# EAGLE design UL-17 (EAGLE 4.11)
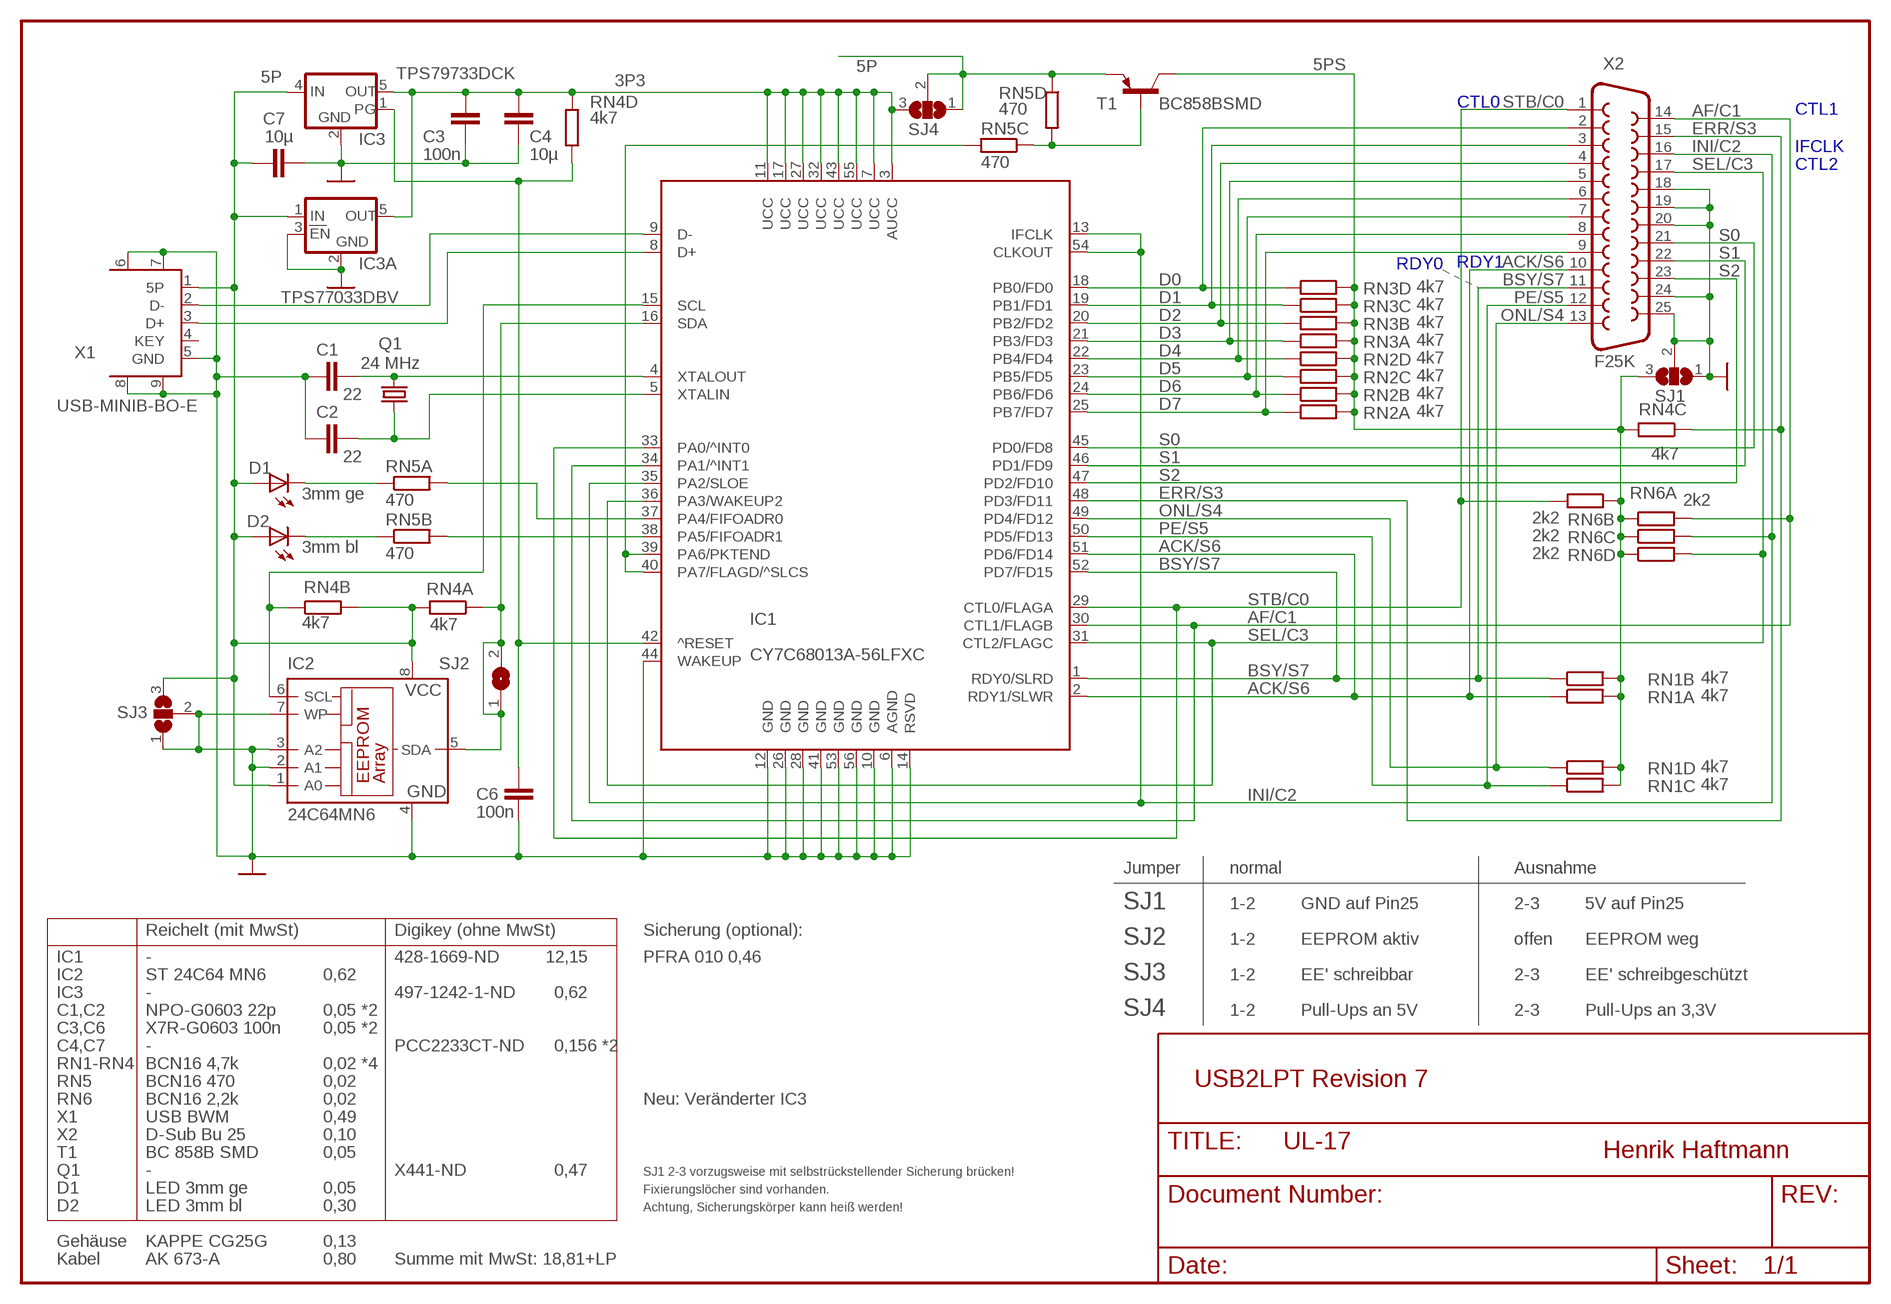
[diagram p0: schematic, sheet 1]

## Parts
C1  22  C-EUC0603  [C0603]
C2  22  C-EUC0603  [C0603]
C3  100n  C-EUC0603  [C0603]
C4  10µ  C-EUC0805  [C0805]
C6  100n  C-EUC0603  [C0603]
C7  10µ  C-EUC0805  [C0805]
D1  3mm ge  LED3MM  [LED3MM]
D2  3mm bl  LED3MM  [LED3MM]
IC1  CY7C68013A-56LFXC  [MLF56]
IC2  24C64MN6  24C32ASN  [SO-08]
IC3  TPS79733DCK  [SOT323-5]
IC3A  TPS77033DBV  [SOT23-5]
Q1  24 MHz  CRYTALHC49U-V  [HC49U-V]
RN1  4k7  RN-4P1206  [R-4P]
RN2  4k7  RN-4P1206  [R-4P]
RN3  4k7  RN-4P1206  [R-4P]
RN4  4k7  RN-4P1206  [R-4P]
RN5  470  RN-4P1206  [R-4P]
RN6  2k2  RN-4P1206  [R-4P]
SJ1  SJ3P  [SJ3P]
SJ2  SJ2P  [SJ2P]
SJ3  SJ3P  [SJ3P]
SJ4  SJ3P  [SJ3P]
T1  BC858BSMD  [SOT23-BEC]
X1  USB-MINIB-BO-E  [USB-MINIB-BU-E]
X2  F25K  [F25K]

## Nets
3P3: C3.2 C4.2 IC1.3(AUCC) IC1.7(UCC) IC1.11(UCC) IC1.17(UCC) IC1.27(UCC) IC1.32(UCC) IC1.43(UCC) IC1.55(UCC) IC3.5(OUT) IC3A.5(OUT) RN4.4 SJ4.3
5P: C7.2 D1.A D2.A IC2.1(A0) IC2.8(VCC) IC3.4(IN) IC3A.1(IN) RN4.7 RN4.8 RN5.4 SJ3.3 SJ4.1 SJ4.2 T1.E X1.1(5P)
5PS: RN1.5 RN1.6 RN1.7 RN1.8 RN2.5 RN2.6 RN2.7 RN2.8 RN3.5 RN3.6 RN3.7 RN3.8 RN4.6 RN6.1 RN6.2 RN6.3 RN6.4 SJ1.3 T1.C
ACK/S6: IC1.2(RDY1/SLWR) IC1.51(PD6/FD14) RN1.1 X2.10
AF/C1: IC1.30(CTL1/FLAGB) IC1.34(PA1/^INT1) RN6.7 X2.14
BSY/S7: IC1.1(RDY0/SLRD) IC1.52(PD7/FD15) RN1.2 X2.11
D0: IC1.18(PB0/FD0) RN3.4 X2.2
D1: IC1.19(PB1/FD1) RN3.3 X2.3
D2: IC1.20(PB2/FD2) RN3.2 X2.4
D3: IC1.21(PB3/FD3) RN3.1 X2.5
D4: IC1.22(PB4/FD4) RN2.4 X2.6
D5: IC1.23(PB5/FD5) RN2.3 X2.7
D6: IC1.24(PB6/FD6) RN2.2 X2.8
D7: IC1.25(PB7/FD7) RN2.1 X2.9
D+: IC1.8(D+) X1.3(D+)
D-: IC1.9(D-) X1.2(D-)
ERR/S3: IC1.48(PD3/FD11) RN4.3 X2.15
GND: C1.2 C2.2 C3.1 C4.1 C6.1 C7.1 IC1.6(AGND) IC1.10(GND) IC1.12(GND) IC1.14(RSVD) IC1.26(GND) IC1.28(GND) IC1.41(GND) IC1.44(WAKEUP) IC1.53(GND) IC1.56(GND) IC2.2(A1) IC2.3(A2) IC2.4(GND) IC2.7(WP) IC3.2(GND) IC3A.2(GND) IC3A.3(/EN) SJ1.1 SJ1.2 SJ3.1 SJ3.2 X1.5(GND) X1.6(GND) X1.7(GND) X1.8(GND) X1.9(GND) X2.18 X2.19 X2.20 X2.24 X2.25
INI/C2: IC1.13(IFCLK) IC1.35(PA2/SLOE) IC1.54(CLKOUT) RN6.6 X2.16
LEDBLAU: IC1.38(PA5/FIFOADR1) RN5.7
LEDGELB: IC1.37(PA4/FIFOADR0) RN5.8
N$1: C2.1 IC1.5(XTALIN) Q1.1
N$2: C1.1 IC1.4(XTALOUT) Q1.2
N$5: D2.K RN5.2
N$7: D1.K RN5.1
N$12: RN5.3 RN5.5 T1.B
N$15: IC1.39(PA6/PKTEND) IC1.40(PA7/FLAGD/^SLCS) RN5.6
ONL/S4: IC1.49(PD4/FD12) RN1.4 X2.13
PE/S5: IC1.50(PD5/FD13) RN1.3 X2.12
RESET: C6.2 IC1.42(^RESET) IC3.1(PG) RN4.5
S0: IC1.45(PD0/FD8) X2.21
S1: IC1.46(PD1/FD9) X2.22
S2: IC1.47(PD2/FD10) X2.23
SCL: IC1.15(SCL) IC2.6(SCL) RN4.2
SDA: IC1.16(SDA) IC2.5(SDA) RN4.1 SJ2.1 SJ2.2
SEL/C3: IC1.31(CTL2/FLAGC) IC1.36(PA3/WAKEUP2) RN6.5 X2.17
STB/C0: IC1.29(CTL0/FLAGA) IC1.33(PA0/^INT0) RN6.8 X2.1
Unconnected: X1.4(KEY)

## Notes on the sheet
- CTL0
- CTL1
- IFCLK
- CTL2
- RDY0 | RDY1
- Jumper | normal | Ausnahme
- SJ1 | 1-2 | GND auf Pin25 | 2-3 | 5V auf Pin25
- Reichelt (mit MwSt) | Digikey (ohne MwSt) | Sicherung (optional):
- SJ2 | 1-2 | EEPROM aktiv | offen | EEPROM weg
- IC1 | - | 428-1669-ND | 12,15 | PFRA 010 0,46
- IC2 | ST 24C64 MN6 | 0,62 | SJ3 | 1-2 | EE' schreibbar | 2-3 | EE' schreibgeschützt
- IC3 | - | 497-1242-1-ND | 0,62
- C1,C2 | NPO-G0603 22p | 0,05 *2 | SJ4 | 1-2 | Pull-Ups an 5V | 2-3 | Pull-Ups an 3,3V
- C3,C6 | X7R-G0603 100n | 0,05 *2
- C4,C7 | - | PCC2233CT-ND | 0,156 *2
- RN1-RN4 | BCN16 4,7k | 0,02 *4
- RN5 | BCN16 470 | 0,02 | USB2LPT Revision 7
- RN6 | BCN16 2,2k | 0,02 | Neu: Veränderter IC3
- X1 | USB BWM | 0,49
- X2 | D-Sub Bu 25 | 0,10
- T1 | BC 858B SMD | 0,05 | Henrik Haftmann
- Q1 | - | X441-ND | 0,47 | SJ1 2-3 vorzugsweise mit selbstrückstellender Sicherung brücken!
- D1 | LED 3mm ge | 0,05 | Fixierungslöcher sind vorhanden.
- D2 | LED 3mm bl | 0,30 | Achtung, Sicherungskörper kann heiß werden!
- Gehäuse | KAPPE CG25G | 0,13
- Kabel | AK 673-A | 0,80 | Summe mit MwSt: 18,81+LP

## Library data of the parts
C1-C4 C6 C7 = rcl:C-EU: CAPACITOR, European symbol
D1 D2 = hs-ul:LED: Leuchtdiode 2 Anschlüsse
IC1 = hs-ul:CY7C68013*-56: Zuordnungstabelle Vorn SSOP56 LF56 Pb Pb-frei Pb Pb-frei FX2 CY7C68013 -56PVC -56PVXC -56LFC -56LFXC FX2LP CY7C68013 A-56PVC A-56PVXC A-56LFC A-56LFXC
IC2 = microchip:24*: Serial EEPROM I2C
IC3 = hs-ul:TPS797*: Längsregler 50 mA, feste Ausgangsspannungen Mit Power-Good-Ausgang, Low-Drop, nur 1,3 µA Querstrom Texas Instruments (kostenlose Muster) alternativ TPS715XX (ohne Power-Good-Ausgang)
IC3A = hs-ul:TPS770*: Längsregler 50 mA, feste Ausgangsspannungen Mit Power-Good-Ausgang, Low-Drop, 17 µA Querstrom Texas Instruments (kostenlose Muster) alternativ TPS788XX
Q1 = crystal:CRYTAL: CRYSTAL
RN1-RN6 = hs-ul:RN-4P: Widerstandsnetzwerk 4 Parallel
SJ1 SJ3 SJ4 = hs-ul:SJ3P: Lötbrücke 3pol. Spaltbreite 0,15 mm
SJ2 = hs-ul:SJ2P: Lötbrücke 2pol. Spaltbreite 0,15 mm
T1 = transistor-pnp:BC858*: PNP Transistror
X1 = hs-ul:USB-MINIB-BO: USB MiniB-Buchse Oberflächenmontage (Zwei Varianten zur Kantenmontage)
X2 = hs-ul:F25: SubD-Buchse korrigiert und verschönert Kantenmontage Reichelt D-SUB BU 25 0,14€

## Board
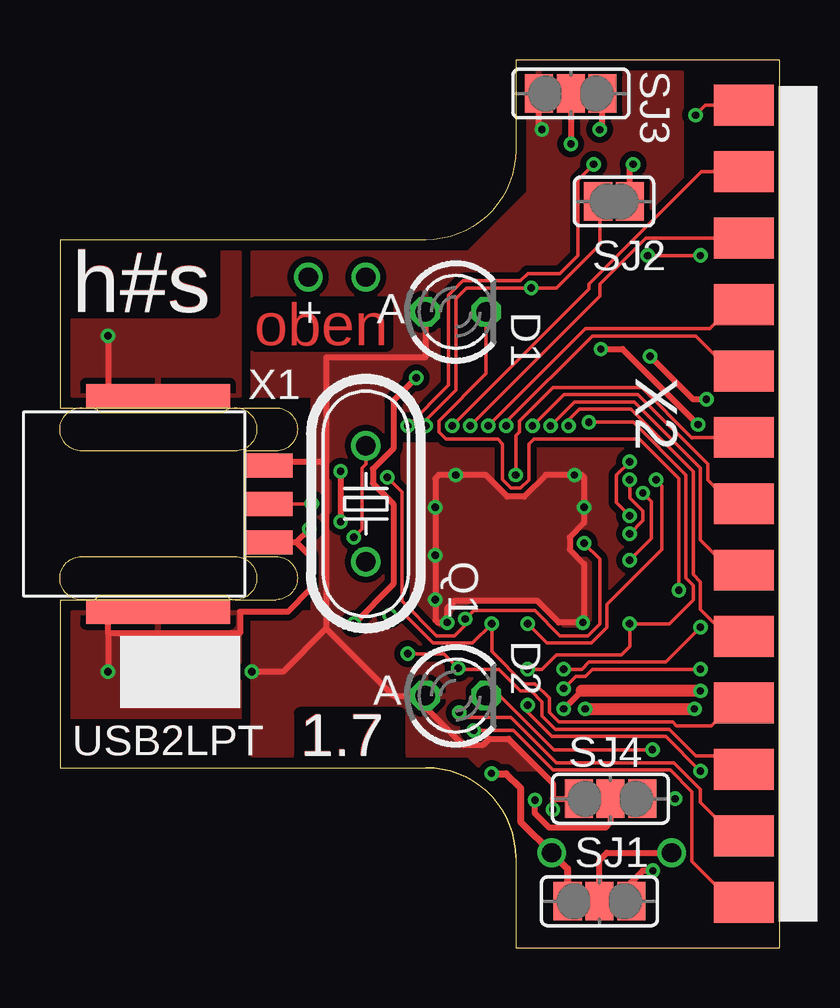
[diagram p1: board, top side]
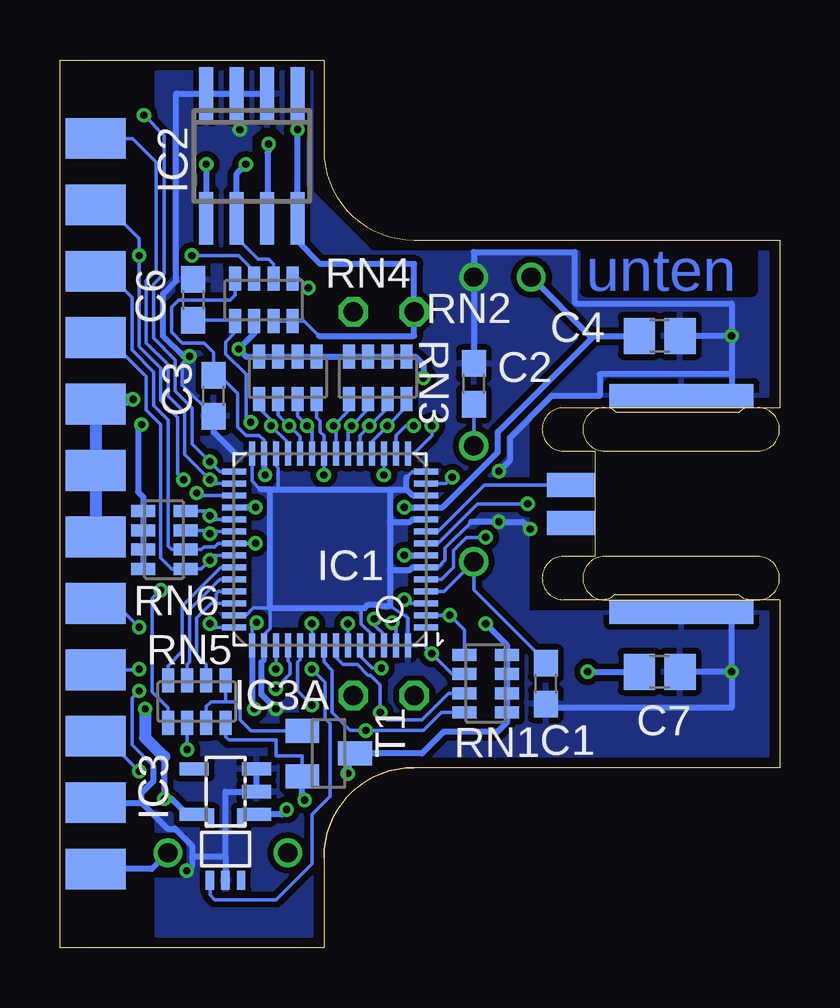
[diagram p2: board, bottom side, seen from below]

Size 30 x 37 mm. Coordinates in mm from the lower left corner, seen from the top.
Outline: 15.25,7.5 0,7.5 0,14.5 1.13,14.5 arc45 1.66,14.66 1.7,14.7 6.9,14.7 6.97,14.63 arc45 7.33,14.5 9,14.5 arc180 9,16.3 7.7,16.3 7.7,20.7 9,20.7 arc180 9,22.5 7.25,22.5 arc45 6.82,22.32 6.8,22.3 1.7,22.3 1.68,22.32 arc45 1.25,22.5 0,22.5 0,29.5 15.25,29.5 arc90 19,33.25 19,37 30,37 30,0 19,0 19,3.75
Outline: 15.25,7.5 arc-90 19,3.75
Outline: 19,3.75 arc90 15.25,7.5
Copper layers (1*16): Top 0.035mm / dielectric 1.4mm / Bottom 0.035mm
Design rules "default": minimum track width 0.15mm, minimum drill 0.3mm, track to track 0.15mm, track to pad 0.15mm, pad to pad 0.15mm, via to via 0.15mm, smd to smd 0mil, copper to edge 0mil, drill to drill 0.15mm, minimum pad ring 0.15mm, minimum via ring 0.15mm, stop-mask expansion 4mil, vias tented up to drill 0.4mm, thermal gap 10mil
Milling: 8 lines

### Footprints (pad centres in the part's own frame; a part is rotated, then mirrored left to right if it is on the bottom)
C0603 = smd 1.1 x 1: 1 -0.85,0; 2 0.85,0
C0805 = smd 1.3 x 1.5: 1 -0.85,0; 2 0.85,0
LED3MM = drill 0.813 octagon: A -1.27,0; K 1.27,0
MLF56 = smd 1 x 0.25: 1 -4,3.25; 2 -4,2.75; 3 -4,2.25; 4 -4,1.75; 5 -4,1.25; 6 -4,0.75; 7 -4,0.25; 8 -4,-0.25; 9 -4,-0.75; 10 -4,-1.25; 11 -4,-1.75; 12 -4,-2.25; 13 -4,-2.75; 14 -4,-3.25; 29 4,-3.25; 30 4,-2.75; 31 4,-2.25; 32 4,-1.75; 33 4,-1.25; 34 4,-0.75; 35 4,-0.25; 36 4,0.25; 37 4,0.75; 38 4,1.25; 39 4,1.75; 40 4,2.25; 41 4,2.75; 42 4,3.25 | smd 0.25 x 1: 15 -3.25,-4; 16 -2.75,-4; 17 -2.25,-4; 18 -1.75,-4; 19 -1.25,-4; 20 -0.75,-4; 21 -0.25,-4; 22 0.25,-4; 23 0.75,-4; 24 1.25,-4; 25 1.75,-4; 26 2.25,-4; 27 2.75,-4; 28 3.25,-4; 43 3.25,4; 44 2.75,4; 45 2.25,4; 46 1.75,4; 47 1.25,4; 48 0.75,4; 49 0.25,4; 50 -0.25,4; 51 -0.75,4; 52 -1.25,4; 53 -1.75,4; 54 -2.25,4; 55 -2.75,4; 56 -3.25,4
SO-08 = smd 0.6 x 2.2: 1 -1.905,-2.6; 2 -0.635,-2.6; 3 0.635,-2.6; 4 1.905,-2.6; 5 1.905,2.6; 6 0.635,2.6; 7 -0.635,2.6; 8 -1.905,2.6
SOT323-5 = smd 0.35 x 0.8: 1 -0.65,-1.3; 2 0,-1.3; 3 0.65,-1.3; 4 0.65,1.3; 5 -0.65,1.3
SOT23-5 = smd 0.55 x 1.2: 1 -0.95,-1.3; 2 0,-1.3; 3 0.95,-1.3; 4 0.95,1.3; 5 -0.95,1.3
HC49U-V = drill 0.813 round: 1 -2.413,0; 2 2.413,0
R-4P = smd 0.5 x 1: 1 -1.2,-0.88; 2 -0.4,-0.88; 3 0.4,-0.88; 4 1.2,-0.88; 5 1.2,0.88; 6 0.4,0.88; 7 -0.4,0.88; 8 -1.2,0.88
SJ3P = smd 1.168 x 1.6: 1 -1.324,0; 2 0,0; 3 1.324,0
SJ2P = smd 1.168 x 1.6: 1 -0.662,0; 2 0.662,0
SOT23-BEC = smd 1 x 1.4: B -0.95,-1.1; C 0,1.1; E 0.95,-1.1
USB-MINIB-BU-E = smd 2 x 1: 1 9.6,1.6; 3 9.6,0; 5 9.6,-1.6 | smd 2 x 1 bottom: 2 9.6,0.8; 4 9.6,-0.8 | smd 6 x 1 bottom: 6 5,4.5; 9 5,-4.5 | smd 6 x 1: 7 5,4.5; 8 5,-4.5
F25K = smd 1.7 x 2.5: 1 -16.612,-1.75; 2 -13.843,-1.75; 3 -11.074,-1.75; 4 -8.306,-1.75; 5 -5.537,-1.75; 6 -2.769,-1.75; 7 0,-1.75; 8 2.769,-1.75; 9 5.537,-1.75; 10 8.306,-1.75; 11 11.074,-1.75; 12 13.843,-1.75; 13 16.612,-1.75 | smd 1.7 x 2.5 bottom: 14 -15.227,-1.75; 15 -12.459,-1.75; 16 -9.69,-1.75; 17 -6.921,-1.75; 18 -4.153,-1.75; 19 -1.384,-1.75; 20 1.384,-1.75; 21 4.153,-1.75; 22 6.921,-1.75; 23 9.69,-1.75; 24 12.459,-1.75; 25 15.227,-1.75

### Placement (x,y rotation side)
C1  9.75,11 270 bottom
C2  12.75,23.5 90 bottom
C3  23.6,23 90 bottom
C4  5,25.5 180 bottom
C6  24.45,27 270 bottom
C7  5,11.5 180 bottom
D1  16.5,26.5 0 top
D2  16.5,10.5 0 top
IC1  18.75,16.6 180 bottom
IC2  22,33 180 bottom
IC3  23.1,4.1 0 bottom
IC3A  23.1,6.5 90 bottom
Q1  12.75,18.5 270 top
RN1  12.25,11 270 bottom
RN2  20.5,23.75 0 bottom
RN3  16.75,23.75 0 bottom
RN4  21.5,27 180 bottom
RN5  24.3,10.25 0 bottom
RN6  25.65,16.99 270 bottom
SJ1  22.49,1.93 180 top
SJ2  23.1,31.1 180 top
SJ3  21.3,35.6 180 top
SJ4  22.95,6.2 0 top
T1  18.8,8.09 270 bottom
X1  -0.91,18.49 0 top
X2  30.25,18.5 270 top

### Tracks (layer width: path | path; a pad name or v marks a point on that pad's centre or on a via)
3P3  (via drill 0.3, 0.8)
  Top 0.15: v25.65,6.2 SJ4.3
  Top 0.25: v16.5,19.7 15.8,19.7 15.65,19.55 v15.65,18.35 v15.65,16.35 v15.65,14.5 15.65,13.65 15.75,13.55 v16.15,13.55 16.15,14.15 16.45,14.45 19.9,14.45 20.8,13.55 v21.8,13.55 21.85,13.6 21.85,16 21.25,16.6 21.25,17.1 21.85,17.7 v21.85,18.35 21.85,19.6 21.75,19.7 v21.45,19.7 20.25,19.7 19.35,18.8 18.65,18.8 17.75,19.7 v16.5,19.7
  Top 0.5: v21.9,9.95 v26.45,9.95
  Bottom 0.15: v16.5,19.7 IC1.17 | v15.65,14.5 15.5,14.35 IC1.3 | IC1.55 16,13.4 v16.15,13.55 | IC1.27 21.5,21.15 21.7,21.35 22.25,21.35 22.6,21.7 22.6,23.1 23.35,23.85 C3.2 23.6,24.8 24,25.2 24.9,25.2 25.35,25.65 25.35,26.7 25.05,27 22.9,27 22.7,27.2 RN4.4 | IC1.43 22,13.35 v21.8,13.55
  Bottom 0.25: IC1.27 21.5,19.75 v21.45,19.7 | v15.65,18.35 IC1.11 14.05,18.35 11.75,20.65 11.75,21.5 7.75,25.5 | v15.65,16.35 IC1.7 | v21.85,18.35 IC1.32 | IC1.43 22,10.05 v21.9,9.95 | 7.75,25.5 C4.2 | 25.65,7.95 v25.65,6.2 25.35,6.2 24.7,5.55 IC3A.5 24.25,5.55 24.1,5.4 IC3.5 | 7.75,25.5 7.9,25.5 v10.35,27.95
  Bottom 0.5: v26.45,9.95 26.45,8.75 25.65,7.95
  pour Top (isolate 0.254): 14.25,21 23.75,21 23.75,12.95 14.25,12.95
5P  (via drill 0.3)
  Top 0.15: SJ4.2 21.65,6.2 SJ4.1
  Top 0.25: 11.1,20.25 11.1,24.6 15.23,24.6 D1.A | 11.1,20.25 11.1,13.3 | 11.1,13.3 13.9,10.5 D2.A 15.23,10.02 16.8,8.45 17.65,8.45 17.9,8.7 18.7,8.7 20.55,6.85 20.55,6.2 | v8,11.5 9.3,11.5 11.1,13.3 | X1.1 8.69,20.25 11.1,20.25 | 20.55,6.2 v20.55,5.75 | v20.09,34.1 v20.09,34.11 19.98,34.22 SJ3.3 | v19.8,6.15 19.8,5.6 20.4,5 22.75,5 22.95,5.2 SJ4.2 | 20.55,6.2 21.65,6.2
  Bottom 0.15: 20.09,30.36 20.1,30.35 | RN4.7 RN4.8 19.82,26.12 19.2,25.5 | IC3.4 22.25,5.4 22.1,5.55 | T1.E 19.9,8 21,8 21,8.65 22.95,8.65 23.05,8.75 | 23.05,8.75 23.07,8.77 | RN5.4 23.1,8.8 23.05,8.75
  Bottom 0.25: IC2.1 v20.09,34.1 IC2.8 20.1,30.2 20.09,30.2 | 20.09,30.2 20.09,30.36 | v8,11.5 C7.2 | 19.2,25.5 15.23,25.5 D1.A 15.23,28.5 19.15,28.5 20.09,29.45 20.09,30.2 | 22.1,5.55 IC3A.1 20.75,5.55 v20.55,5.75 | v19.8,6.15 19.9,6.25 T1.E
  pour Top (isolate 0.254, rank 2): 19.5,36.5 25.95,36.5 25.95,7.4 17.6,7.4 17,8 8,8 8,14 10.5,14 10.5,23 8,23 8,29 17,29 19.5,31.5
5PS  (via drill 0.3, 0.8)
  Top 0.25: v12.25,13.5 13.9,15.15 13.9,18.5 13.05,19.35 13.05,19.95 13.9,20.8 13.9,22.8 v14.85,23.75 | v26.6,21.8 23.45,24.95 v22.55,24.95
  Top 0.3: SJ1.3 21.17,3.28 v20.5,3.95 19.2,5.25 19.2,6.65 18.6,7.25 v18,7.25 v17.99,7.26
  Bottom 0.25: v14.85,23.75 14.85,24.3 15.18,24.63 RN3.5 RN3.6 RN3.7 RN3.8 RN2.5 RN2.6 RN2.7 RN2.8 22.23,24.63 v22.55,24.95 21.9,25.6 RN4.6 | v12.25,13.5 11.37,12.62 RN1.8 RN1.7 RN1.6 RN1.5 11.37,9.38 11.76,8.99 14.01,8.99 14.91,8.09 T1.C | RN6.4 RN6.3 26.53,16.65 | 26.53,16.65 RN6.2 RN6.1 | 26.53,16.65 RN6.3 | RN6.1 | RN6.1 26.53,18.78 26.75,19 26.75,21.65 v26.6,21.8 | v18,7.25 v17.99,7.26
  Bottom 0.3: T1.C 18,7.79 v18,7.25
ACK/S6  (via drill 0.3)
  Top 0.15: X2.10 28.09,10.19 27.15,9.25 25.7,9.25 25.55,9.4 20.8,9.4 20.4,9.8 20.4,10.4 19.8,11 19.35,11 18,12.35 v18,13.5 17.2,12.7 15.55,12.7 14.4,13.85 v13.75,13.85
  Bottom 0.15: v18,13.5 IC1.51 | IC1.2 v13.75,13.85 13.13,13.23 RN1.1
AF/C1  (via drill 0.3)
  Top 0.15: v23.75,17.25 24.3,17.8 24.3,18.2 23.75,18.75 v23.75,19.5
  Bottom 0.15: X2.14 26.98,33.73 26,32.75 26,28.2 26.4,27.8 26.4,25.2 25.5,24.3 25.5,23 24.8,22.3 24.8,20.55 v23.75,19.5 23.6,19.35 IC1.30 | IC1.34 23.65,17.35 v23.75,17.25 23.89,17.39 RN6.7
BSY/S7  (via drill 0.3)
  Top 0.15: v14.5,12.25 16,12.25 v16.6,11.65 16.65,11.6 18.3,11.6 19.2,10.7 19.65,10.7 20.1,10.25 20.1,9.65 20.65,9.1 25.4,9.1 26.5,8 27.93,8 X2.11
  Bottom 0.15: IC1.52 17.5,12.15 17,11.65 v16.6,11.65 | IC1.1 14.75,12.5 v14.5,12.25 13.65,11.4 RN1.2
D0  (via drill 0.3)
  Top 0.15: X2.2 26.74,32.34 22.05,27.65 22.05,27.45 v16.35,21.75
  Bottom 0.15: IC1.18 17,21.1 v16.35,21.75 15.55,22.55 RN3.4
D1  (via drill 0.3)
  Top 0.15: X2.3 24.42,29.57 22.5,27.65 22.5,27.15 v17.1,21.75
  Bottom 0.15: IC1.19 17.5,21.35 v17.1,21.75 16.35,22.5 RN3.3
D2  (via drill 0.3)
  Top 0.15: X2.4 28.5,26.5 27.8,26.5 27.1,25.8 21.9,25.8 v17.85,21.75
  Bottom 0.15: IC1.20 18,21.6 v17.85,21.75 17.15,22.45 RN3.2
D3  (via drill 0.3)
  Top 0.15: X2.5 27.96,24.04 26.5,25.5 22.2,25.5 18.6,21.9 v18.6,21.75
  Bottom 0.15: IC1.21 18.5,21.65 v18.6,21.75 17.95,22.4 RN3.1
D4  (via drill 0.3)
  Top 0.15: X2.6 26.35,21.27 26.35,21.25 24.25,23.35 20.55,23.35 19.15,21.95 19.15,21.5 19,21.35 v19,19.7
  Bottom 0.15: v19,19.7 IC1.22 19,21.35 19.15,21.5 19.15,21.95 19.3,22.1 RN2.4
D5  (via drill 0.3)
  Top 0.15: X2.7 28,18.5 27,19.5 27,20.15 24.1,23.05 21,23.05 v19.7,21.75
  Bottom 0.15: IC1.23 19.5,21.55 v19.7,21.75 20.1,22.15 RN2.3
D6  (via drill 0.3)
  Top 0.15: X2.8 27.97,15.73 26.7,17 26.7,20 23.95,22.75 21.45,22.75 v20.45,21.75
  Bottom 0.15: IC1.24 20,21.3 v20.45,21.75 20.9,22.2 RN2.2
D7  (via drill 0.3)
  Top 0.15: X2.9 27.84,12.96 26.7,14.1 26.7,15.25 26.4,15.55 26.4,19.85 23.8,22.45 21.65,22.45 21.2,22 v21.2,21.75
  Bottom 0.15: IC1.25 20.5,21.05 v21.2,21.75 21.2,22 21.7,22.5 RN2.1
D+  (via drill 0.3)
  Top 0.15: X1.3 v10.49,18.49 v10.5,18.5
  Bottom 0.15: v10.5,18.5 12.6,18.5 14.25,16.85 IC1.8
D-
  Bottom 0.15: IC1.9 14.25,17.35 12.31,19.29 X1.2
ERR/S3  (via drill 0.3)
  Top 0.15: v24.85,19.5 25.1,19.25 25.1,16.6 22.8,14.3 22.8,13.35 22.15,12.7 20.3,12.7 v19.5,13.5 | v24.5,28.85 v26.7,28.85
  Bottom 0.15: v24.85,19.5 25.1,19.75 25.1,22.1 25.8,22.8 25.8,24.15 26.7,25.05 v26.7,28.85 26.7,29.55 28.11,30.96 X2.15 | v19.5,13.5 IC1.48 | RN4.3 21.9,28.2 22.55,28.85 v24.5,28.85
GND  (via drill 0.3, 0.8)
  Top 0.15: SJ3.1 SJ3.2 | 22.55,1.93 SJ1.2 | SJ1.1 22.55,1.93 | 22.55,1.93 22.55,1.95
  Top 0.25: v24.72,3.2 24.3,3.2 23.8,2.7 23.81,2.69 SJ1.1 | v26.95,22.85 26.4,22.85 v24.6,24.65 | v11.7,19.85 v11.7,17.75 | v10.4,17.45 9.85,16.9 | 9.85,16.9 9.84,16.89 8.76,16.89 8.75,16.9 | 9.85,16.9 10.4,16.35 10.4,14.9 9.5,14 7.5,14 7.5,13.1 2,13.1 | 21.75,10.7 v21,9.95 | 8.75,16.9 8.74,16.89 | 2,13.1 v2,11.5 | 2,13.1 2,13.99 | v2,25.5 2,23 | 2,23 2,22.99 | SJ3.2 v21.3,33.5 | SJ3.1 22.62,34.22 v22.5,34.1 | 2,23 2.1,23 2.11,22.99 X1.7 | 8.74,16.89 X1.5 | 8.74,16.89 8.75,16.89 8.75,16.9 | v25.5,3.95 22.8,3.95 22.49,3.64 SJ1.2
  Top 0.5: v26.7,10.7 21.75,10.7
  Bottom 0.15: v24.6,24.65 24.9,24.35 24.9,23.45 C3.1 | 14.25,15.85 13.95,16.15 13.95,16.65 12.85,17.75 | v26.7,10.7 27,10.4 27,8.45 26.1,7.55 | 21.3,30.35 21.35,30.4 21.37,30.41 | IC1.28 22,19.45 21.65,19.1 | IC1.26 21,20.1 20.9,20 20.9,19.1 | IC1.14 15.3,19.85 15.55,19.6 | IC1.56 15.5,13.75 16.25,14.25 | IC1.41 22.25,13.85 21.95,14.15 21.25,14.15 21.25,13.3 21.5,13.05 IC1.44 | IC1.53 17,13.05 17.45,13.5 17.45,14.15
  Bottom 0.25: 24.5,3.8 24.5,4.25 25.2,4.95 25.51,4.95 26.6,6.04 | 24.5,3.8 24.5,3.4 24.7,3.2 v24.72,3.2 | 12.85,17.75 v11.7,17.75 10.7,17.75 v10.4,17.45 | v11.7,19.85 11.25,20.3 11.25,21.25 9.55,22.95 | 9.55,22.95 9.51,22.99 | v24.6,24.65 24.85,24.65 25.7,25.5 25.7,27.25 25.15,27.8 25.15,35.6 IC2.4 | 22.7,20.6 23.6,21.5 C3.1 | v2,11.5 C7.1 | v2,25.5 C4.1 | 9.55,22.95 9.5,23 7.5,23 7.5,23.9 2,23.9 | 21.5,12 21.6,11.9 21.6,10.55 v21,9.95 | X2.24 26.6,6.04 | 26.1,7.55 26.1,6.95 26.6,6.45 26.6,6.04 | IC2.4 | v2,11.5 2,13.99 | 9.75,10 2,10 v2,11.5 | v2,25.5 2,23.9 | 2,23.9 2,23 | 2,23 2,22.99 | v2,25.5 2,26.85 8.5,26.85 8.55,26.9 8.55,29 12.75,29 v12.75,27.95 C2.2 | 23.1,3.8 23.1,6.5 IC3A.2 IC3A.3 | 23.1,3.8 IC3.2 | 24.5,3.8 23.1,3.8 | 21.35,30.4 IC2.7 | 21.35,30.4 21.3,30.4 | 21.35,30.4 21.35,33.15 21.3,33.2 v21.3,33.5 | IC1.10 15.3,17.85 15.4,17.75 16.25,17.75 | 16.25,19.1 16.25,17.75 | 16.25,19.1 20.9,19.1 21.25,19.1 | 21.25,19.1 21.65,19.1 | IC1.12 15.3,18.85 15.55,19.1 | 16.25,19.1 15.55,19.1 | 15.55,19.1 15.55,19.6 | 16.25,17.75 16.25,15.75 | IC1.6 15.3,15.85 15.4,15.75 16.25,15.75 | 21.25,19.1 21.25,14.15 17.45,14.15 17.3,14.15 17.15,14.3 16.65,14.3 16.6,14.25 16.25,14.25 16.25,15.75 | SJ3.1 IC2.3 IC2.4 | SJ3.1 22.62,34.22 v22.5,34.1 | SJ3.1 IC2.2 | 2,23 2.05,23 2.05,22.99 X1.7 | X2.25 26.18,3.27 v25.5,3.95
  Bottom 0.5: v26.95,22.85 28.31,22.85 28.31,22.84 X2.18 | X2.20 X2.19 | X2.19 | X2.18 | X2.19 X2.18
  pour Top (isolate 0.254, rank 2): 0.5,14 7.5,14 7.5,8 0.5,8
  pour Bottom (isolate 0.254, rank 2): 26,36.5 26,4.85 24.65,4.85 24.65,2.85 26,2.85 26,0.5 19.5,0.5 19.5,5.5 17,8 0.5,8 0.5,14 10.5,14 10.5,23 0.5,23 0.5,29 17,29 19.5,31.5 19.5,36.5 21.45,36.5 21.45,34.25 21,34.25 20.55,33.8 20.55,33.35 20.85,33.05 20.85,31.85 20.7,31.7 20.7,28.85 22.05,28.85 22.05,31.7 21.9,31.85 21.9,33.05 22.05,33.2 22.05,33.8 21.6,34.25 21.6,36.5
  pour Top (isolate 0.254, rank 2): 0.5,29 0.5,23 7.5,23 7.5,29
INI/C2  (via drill 0.3)
  Top 0.15: v13.65,19.6 14.25,19 14.25,14.45 15.7,13 16.45,13 16.9,13.45 v16.9,13.7 17.25,14.05 19.8,14.05 20.85,13 22,13 22.5,13.5 22.5,16.2 v21.85,16.85
  Bottom 0.15: X2.16 28.09,28.19 27,27.1 27,24.9 26.1,24 26.1,22.6 25.5,22 25.5,16.75 25.34,16.59 RN6.6 24.11,16.59 24,16.7 23.55,16.7 23.4,16.85 IC1.35 v21.85,16.85 | IC1.54 16.5,13.05 16.9,13.45 v16.9,13.7 | IC1.13 13.9,19.35 v13.65,19.6
LEDBLAU
  Bottom 0.15: IC1.38 23.35,15.35 24.6,14.1 24.6,11.9 24.7,11.8 RN5.7
LEDGELB
  Bottom 0.15: IC1.37 23.3,15.85 24.9,14.25 24.9,12.35 25.5,11.75 RN5.8
N$1  (via drill 0.3)
  Top 0.15: Q1.1 12.75,20.15 12.6,20 12.6,17.45 v12.25,17.1
  Bottom 0.15: v12.25,17.1 13.05,17.1 13.6,16.55 13.6,15.85 14.1,15.35 IC1.5 | C2.1 Q1.1
N$2
  Bottom 0.15: IC1.4 14,14.85 Q1.2 | Q1.2 | C1.1 9.75,11.9 12.75,14.9 Q1.2
N$5  (via drill 0.3)
  Top 0.15: D2.K 18.35,10.5 20.6,8.25 v24.7,8.25
  Bottom 0.15: RN5.2 v24.7,8.25
N$7  (via drill 0.3)
  Top 0.15: v25.8,14.9 25.8,19.55 24.15,21.2 19.75,21.2 19.55,21 19.55,19.5 19.2,19.15 18.8,19.15 18.45,19.5 18.45,21 18.25,21.2 16.1,21.2 15.8,21.5 15.8,21.95 17.77,23.92 D1.K
  Bottom 0.15: v25.8,14.9 26.15,14.55 26.15,10.65 25.5,10 RN5.1
N$12
  Bottom 0.15: RN5.3 23.9,10.05 23.7,10.25 23.1,10.25 | 23.1,10.25 22.75,10.25 22.5,10 22.5,9.5 22.04,9.04 T1.B | RN5.5 23.1,10.25
N$15
  Bottom 0.15: 23.5,14.35 IC1.40 | 23.5,14.35 23.5,14.75 23.4,14.85 IC1.39 | 23.5,14.35 23.7,14.35 24.3,13.75 24.3,12.2 23.9,11.8 RN5.6
ONL/S4  (via drill 0.3)
  Top 0.15: X2.13 28.06,1.89 26.35,3.6 26.35,6.5 25.45,7.4 20.55,7.4 18.9,9.05 v17.25,9.05
  Bottom 0.15: RN1.4 14.1,9.8 14.85,9.05 v17.25,9.05 17.9,9.05 18.65,9.8 18.65,11.55 19,11.9 IC1.49
PE/S5  (via drill 0.3)
  Top 0.15: X2.12 28.09,4.66 26.7,6.05 26.7,6.6 25.6,7.7 20.7,7.7 18.8,9.6 16.85,9.6 v16.65,9.8
  Bottom 0.15: RN1.3 13.8,10.6 14.9,9.5 16.35,9.5 v16.65,9.8 16.65,10.95 17.05,11.35 17.15,11.35 17.6,11.8 18.2,11.8 18.5,12.1 IC1.50
RESET  (via drill 0.3)
  Top 0.15: v22.05,21.9 23.9,21.9 26.1,19.7 26.1,15.4 26.4,15.1 26.4,14.5 25.4,13.5 v23.75,13.5 23.75,12.55 23.4,12.2 20.7,12.2 20.1,11.6 v19.5,11.6
  Bottom 0.15: v22.05,21.9 22.25,22.1 22.25,23.9 23.1,24.75 23.1,25.25 22.7,25.65 RN4.5 22.7,26.15 C6.2 | IC1.42 23.6,13.35 v23.75,13.5 | v19.5,11.6 18.95,11.05 18.95,9.55 18.75,9.35 18.75,6.3 19.5,5.55 19.5,3.5 21,2 23.55,2 23.75,2.2 IC3.1
S0  (via drill 0.3)
  Top 0.15: v26.7,13.35 25.25,11.9 22.05,11.9 21.75,11.6 v21,11.6
  Bottom 0.15: X2.21 27.7,14.35 v26.7,13.35 | v21,11.6 IC1.45
S1  (via drill 0.3)
  Top 0.15: v26.7,11.6 22.2,11.6 21.9,11.3 21.5,11.3 v21,10.8
  Bottom 0.15: X2.22 26.72,11.58 v26.7,11.6 | IC1.46 20.5,11.95 20.4,11.85 20.4,11.4 v21,10.8
S2  (via drill 0.3)
  Top 0.15: v26.7,7.35 25.25,8.8 20.5,8.8 19.5,9.8 v19.5,10.1
  Bottom 0.15: X2.23 28.16,8.81 v26.7,7.35 | IC1.47 20,12 20.1,11.9 20.1,10.7 v19.5,10.1
SCL  (via drill 0.3)
  Top 0.15: v22.25,32.65 21.6,32 21.6,28.85 20.85,28.1 19.5,28.1 19.2,27.8 16.8,27.8 16.2,27.2 16.2,23.45 v14.5,21.75
  Bottom 0.15: 15.55,20.6 IC1.15 15.25,20.6 14.5,21.35 v14.5,21.75 | IC2.6 22.63,29.59 21.75,28.7 21.3,28.7 21.1,28.5 RN4.2
  Bottom 0.25: IC2.6 22.63,32.27 v22.25,32.65
SDA  (via drill 0.3)
  Top 0.15: v15.25,21.75 15.25,22 16.5,23.25 16.5,27.05 16.95,27.5 v19.65,27.5 20.7,27.5 22.5,29.3 22.5,31.04 SJ2.2 SJ2.1
  Top 0.25: SJ2.1 23.76,32.51 v23.9,32.65
  Bottom 0.15: v15.25,21.75 15.6,21.75 16,21.35 IC1.16 | RN4.1 20.03,27.88 v19.65,27.5 | 23.9,30.45 23.91,30.45 IC2.5
  Bottom 0.25: v23.9,32.65 23.9,30.45
SEL/C3  (via drill 0.3)
  Top 0.15: v23.75,16.15 24.65,17.05 24.65,18.6 v24.3,18.95
  Bottom 0.15: IC1.31 24.2,18.85 v24.3,18.95 | X2.17 28.02,25.42 26.4,23.8 26.4,22.4 25.8,21.8 25.8,16.25 25.34,15.79 RN6.5 24.11,15.79 v23.75,16.15 23.55,16.35 IC1.36
STB/C0  (via drill 0.3)
  Top 0.15: X2.1 26.91,35.11 v26.5,34.7 | v23.75,20.25 23.2,19.7 23.2,18.55 v23.75,18
  Bottom 0.15: v26.5,34.7 25.65,33.85 25.65,28.1 26.1,27.65 26.1,25.4 25.2,24.5 25.2,23.2 24.5,22.5 24.5,21 v23.75,20.25 23.35,19.85 IC1.29 | IC1.33 23.6,17.85 v23.75,18 23.94,18.19 RN6.8

### Text on the board
Top: h#s | oben | USB2LPT | 1.7
Bottom: unten
tPlace: h#s | A | + | A | USB2LPT | 1.7
Measures: 8 | 37 | 22 | R3,75 | 11 | 30
Document: 1 Winkel-Fehler ist OK